# EAGLE schematic usb port c with cp2101 (EAGLE 9.6.2)
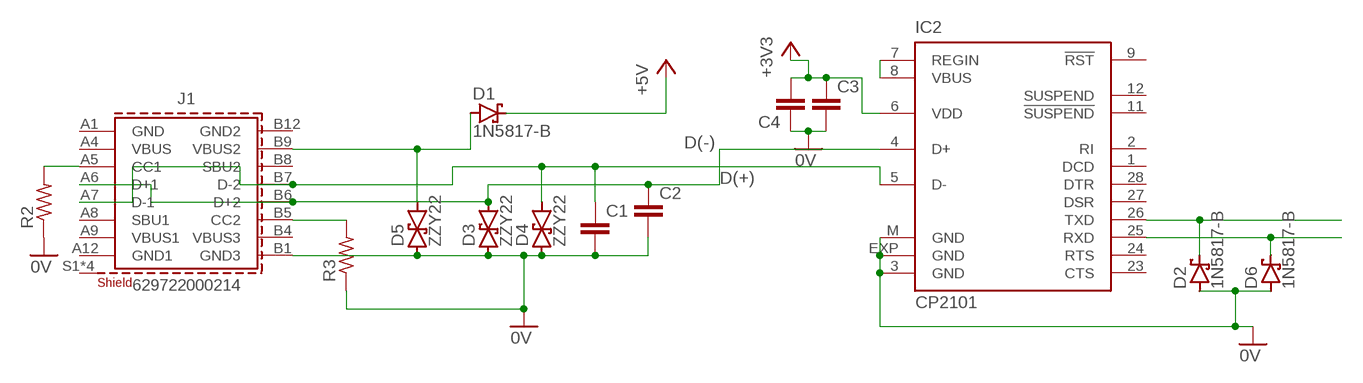
[diagram p0: schematic, sheet 1]

## Parts
C1  C-EUHPC0201  [HPC0201]
C2  C-EUHPC0201  [HPC0201]
C3  C-EUHPC0201  [HPC0201]
C4  C-EUHPC0201  [HPC0201]
D1  1N5817-B  [DO41-7.6]
D2  1N5817-B  [DO41-7.6]
D3  ZZY22  [P3-15]
D4  ZZY22  [P3-15]
D5  ZZY22  [P3-15]
D6  1N5817-B  [DO41-7.6]
IC2  CP2101  [MLP28]
J1  629722000214  [629722000214]
R2  R-US_0207/5V  [0207/5V]
R3  R-US_0207/5V  [0207/5V]

## Nets
0V: C1.2 C2.2 C3.2 C4.1 D2.A D3.A D4.A D5.A D6.A IC2.3(GND) IC2.EXP(GND) IC2.M(GND) J1.B1(GND3) R2.1 R3.1
+3V3: C3.1 C4.2 IC2.6(VDD)
+5V: D1.C
D(+): C2.1 D3.C IC2.4(D+) J1.A6(D+1) J1.B6(D+2)
D(-): C1.1 D4.C IC2.5(D-) J1.A7(D-1) J1.B7(D-2)
N$1: J1.A5(CC1) R2.2
N$2: IC2.7(REGIN) IC2.8(VBUS)
N$3: J1.B5(CC2) R3.2
N$5: D6.C IC2.25(RXD)
N$7: D2.C IC2.26(TXD)
N$8: D1.A D5.C J1.B9(VBUS2)
Unconnected: IC2.1(DCD) IC2.2(RI) IC2.9(!RST) IC2.11(!SUSPEND) IC2.12(SUSPEND) IC2.23(CTS) IC2.24(RTS) IC2.27(DSR) IC2.28(DTR) J1.A1(GND) J1.A4(VBUS) J1.A8(SBU1) J1.A9(VBUS1) J1.A12(GND1) J1.B4(VBUS3) J1.B8(SBU2) J1.B12(GND2) J1.S1(SHIELD) J1.S2(SHIELD) J1.S3(SHIELD) J1.S4(SHIELD)

## Library data of the parts
C1-C4 = rcl:C-EU: CAPACITOR, European symbol; SPICEPREFIX: C
D1 D2 D6 = diode:1N581*: 1.0A SCHOTTKY BARRIER RECTIFIER Source: http://www.diodes.com/datasheets/ds23001.pdf
D3-D5 = diode:ZZY22: DIODE
IC2 = silabs:CP210*: Single-Chip USB to UART Bridge Source: www.silabs.com .. CP2101.pdf / cp2102.pdf; MF: FARNELL; MPN: CP2102-GM; OC_FARNELL: 9282130; OC_NEWARK: 30K5635
J1 = Eagle_WR-USB (rev22c):629722000214: WR-COM USB 2.0 Type C Plug Vertical SMT Kind Properties Durability 10 000 Mating cycles Gender Receptacle Type Horizontal General Information Operating Temperature -40 up to +85 °C Electrical Properties Working Voltage 20 V (DC) Withstanding Voltage 100 V (AC) Contact Resistance 40 mΩ Material Properties Insulator Material LCP Insulator Flammability Rating UL94 V-0 Insulator Color Black Contact Material Brass Contact Plating Gold over Nickel Contact Type Stamped Shielding Material Steel Shielding Plating Nickel (Ni) <https://www.we-online.com/catalog/media/o689297v209%20family-wr-com-629722000214.jpg> Details see: www.we-online.com/catalog/WR-COM_USB_20_TYPE_C_RECEPTACLE_HORIZONTAL_SMT <www.we-online.com/catalog/WR-COM_USB_20_TYPE_C_RECEPTACLE_HORIZONTAL_SMT/?utm_source=eagle_model&utm_medium=description_link&utm_campaign=eisos_eagle> Updated by Ella Wu 2022-11-15 2022 (C) Würth Elektronik; APPLICATION: USB 2.0; DATASHEET-URL: https://www.we-online.com/redexpert/spec/629722000214?ae; GERDER: Receptacle; INTERFACE-TYPE: Type C; IR: 5A; MOUNT: SMT; PACKAGING: Tape and Reel; PART-NUMBER: 629722000214; PINS: 16; TYPE: Horizontal; WORKING-VOLTAGE: 20V(AC)
R2 R3 = rcl:R-US_: RESISTOR, American symbol; SPICEPREFIX: R